# EAGLE design Arduino Electronic Load_Ver06 (EAGLE 7.4.0)
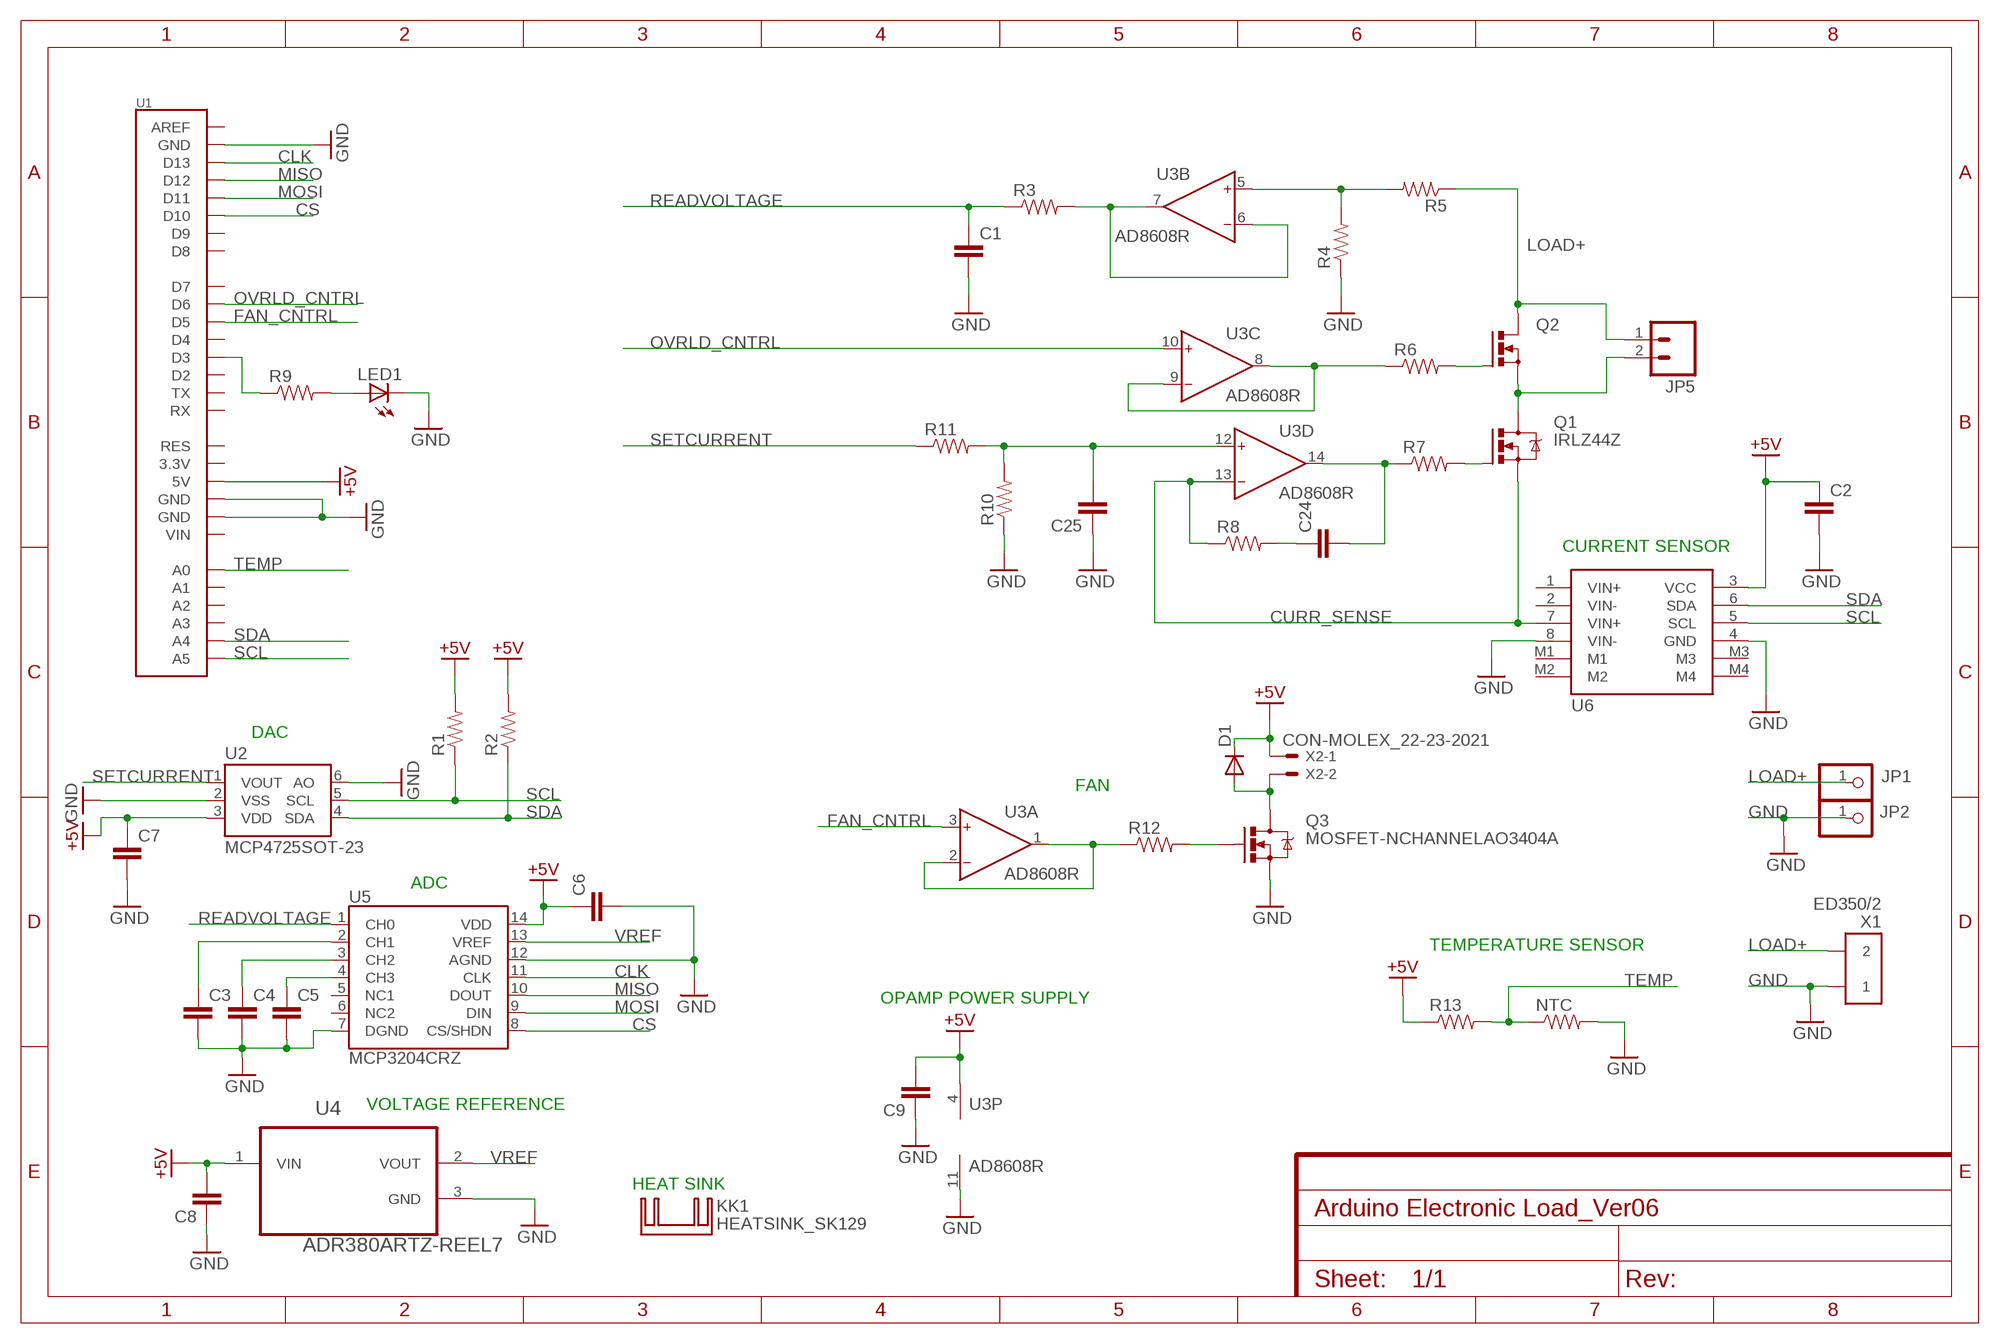
[diagram p0: schematic, sheet 1]

## Parts
C1  CAP0603-CAP  [0603-CAP]
C2  CAP0603-CAP  [0603-CAP]
C3  CAP0603-CAP  [0603-CAP]
C4  CAP0603-CAP  [0603-CAP]
C5  CAP0603-CAP  [0603-CAP]
C6  CAP0603-CAP  [0603-CAP]
C7  CAP0603-CAP  [0603-CAP]
C8  CAP0603-CAP  [0603-CAP]
C9  CAP0603-CAP  [0603-CAP]
C24  CAP0603-CAP  [0603-CAP]
C25  CAP0603-CAP  [0603-CAP]
D1  DIODEPTH  [DIODE-1N4001]
JP1  PINHEAD_PINHD-1X1  [PINHEAD_1X01]
JP2  PINHEAD_PINHD-1X1  [PINHEAD_1X01]
JP5  M02  [1X02_LONGPADS]
KK1  HEATSINK_SK129  [HEATSINK_SK129-HOLE]
LED1  LED5MM  [LED5MM]
NTC  RESISTOR0402-RES  [0402-RES]
Q1  IRLZ44Z  [TO220BV_1]
Q2  PMOSFET_NTO220BV  [TO220BV]
Q3  MOSFET-NCHANNELAO3404A  [SOT23-3]
R1  RESISTOR0603-RES  [0603-RES]
R2  RESISTOR0603-RES  [0603-RES]
R3  RESISTOR0603-RES  [0603-RES]
R4  RESISTOR0603-RES  [0603-RES]
R5  RESISTOR0603-RES  [0603-RES]
R6  RESISTOR0603-RES  [0603-RES]
R7  RESISTOR0603-RES  [0603-RES]
R8  RESISTOR0603-RES  [0603-RES]
R9  RESISTOR0603-RES  [0603-RES]
R10  RESISTOR0603-RES  [0603-RES]
R11  RESISTOR0603-RES  [0603-RES]
R12  RESISTOR0603-RES  [0603-RES]
R13  RESISTOR0603-RES  [0603-RES]
U1  ARDUINO_SHIELD  [DUEMILANOVE_SHIELD]
U2  MCP4725SOT-23  [SOT23-6]
U3  AD8608R  [SO14]
U4  ADR380ARTZ-REEL7  [SOT95P237X112-3N]
U5  MCP3204CRZ  [SOIC-14]
U6  INA219  [INA219]
X1  ED350/2  [ED350/2]
X2  CON-MOLEX_22-23-2021  [CON-MOLEX_22-23-2021]

## Nets
+5V: C2.1 C6.1 C7.1 C8.2 C9.2 D1.C R1.2 R2.2 R13.1 U1.5V U2.3(VDD) U3.4(P:V+) U4.1(VIN) U5.14(VDD) U6.3(VCC) X2.1
CLK: U1.D13 U5.11(CLK)
CS: U1.D10 U5.8(CS/SHDN)
CURR_SENSE: Q1.S R8.1 U3.13(D:IN-) U6.7(VIN+)
FAN_CNTRL: U1.D5 U3.3(A:IN+)
GND: C1.2 C2.2 C3.2 C4.2 C5.2 C6.2 C7.2 C8.1 C9.1 C25.1 JP2.1 LED1.K(C) NTC.2 Q3.2(S) R4.1 R10.1 U1.GND@0(GND) U1.GND@1(GND) U1.GND@2(GND) U2.2(VSS) U2.6(AO) U3.11(P:V-) U4.3(GND) U5.7(DGND) U5.12(AGND) U6.4(GND) U6.8(VIN-) X1.P$1
LOAD+: JP1.1 JP5.1 Q2.D R5.1 X1.P$2
MISO: U1.D12 U5.10(DOUT)
MOSI: U1.D11 U5.9(DIN)
N$1: R9.1 U1.D3
N$2: LED1.A R9.2
N$3: R12.1 U3.1(A:OUT) U3.2(A:IN-)
N$4: Q3.1(G) R12.2
N$6: C3.1 U5.2(CH1)
N$7: R3.2 U3.6(B:IN-) U3.7(B:OUT)
N$8: R6.1 U3.8(C:OUT) U3.9(C:IN-)
N$9: R4.2 R5.2 U3.5(B:IN+)
N$10: Q2.G R6.2
N$11: JP5.2 Q1.D Q2.S
N$12: Q1.G R7.2
N$13: C24.2 R7.1 U3.14(D:OUT)
N$14: C4.1 U5.3(CH2)
N$15: C24.1 R8.2
N$16: C5.1 U5.4(CH3)
N$17: C25.2 R10.2 R11.2 U3.12(D:IN+)
N$18: D1.A Q3.3(D) X2.2
OVRLD_CNTRL: U1.D6 U3.10(C:IN+)
READVOLTAGE: C1.1 R3.1 U5.1(CH0)
SCL: R1.1 U1.A5 U2.5(SCL) U6.5(SCL)
SDA: R2.1 U1.A4 U2.4(SDA) U6.6(SDA)
SETCURRENT: R11.1 U2.1(VOUT)
TEMP: NTC.1 R13.2 U1.A0
VREF: U4.2(VOUT) U5.13(VREF)
Unconnected: U1.3.3V U1.A1 U1.A2 U1.A3 U1.AREF U1.D2 U1.D4 U1.D7 U1.D8 U1.D9 U1.RES U1.RX U1.TX U1.VIN U5.5(NC1) U5.6(NC2) U6.1(VIN+) U6.2(VIN-) U6.M1 U6.M2 U6.M3 U6.M4

## Notes on the sheet
- CURRENT SENSOR
- DAC
- FAN
- ADC
- TEMPERATURE SENSOR
- OPAMP POWER SUPPLY
- VOLTAGE REFERENCE
- HEAT SINK

## Library data of the parts
C1-C5 = myLibrary:CAP: Capacitor Standard 0603 ceramic capacitor, and 0.1" leaded capacitor.; MANUFACTURING: Murata Electronics North America; MANUFACTURING_NUM: GRM188R71C104KA01D; PACKAGE: GRM188R71C104KA01D; VENDOR: 0603-CAP; VENDOR_PART_NUM: Digikey
C6-C9 C24 C25 = myLibrary:CAP: Capacitor Standard 0603 ceramic capacitor, and 0.1" leaded capacitor.
D1 = myLibrary:DIODE: Diode These are standard reverse protection diodes and small signal diodes. SMA package can handle up to about 1A. SOD-323 can handle about 200mA. What the SOD-323 package when ordering, there are some mfgs out there that are 5-pin packages.
JP1 JP2 = myLibrary:PINHEAD_PINHD-1X1: PIN HEADER
JP5 = myLibrary:M02: Header 2 Standard 2-pin 0.1" header. Use with straight break away headers (SKU : PRT-00116), right angle break away headers (PRT-00553), swiss pins (PRT-00743), machine pins (PRT-00117), and female headers (PRT-00115). Molex polarized connector foot print use with SKU : PRT-08233 with associated crimp pins and housings.
KK1 = myLibrary:HEATSINK_SK129: HEATSINK manufacturer Fischer/distributor Buerklin
LED1 = myLibrary:LED: LEDs Standard schematic elements and footprints for 5mm, 3mm, 1206, and 0603 sized LEDs. 5mm - Spark Fun Electronics SKU : COM-00529 (and others)
NTC R1-R13 = myLibrary:RESISTOR: Resistor Basic schematic elements and footprints for 0603, 1206, and PTH 1/10th watt (small) resistors.
Q1 = myLibrary:IRLZ44Z: N-Channel HEXFET® Power MOSFET Logic Level AUTOMOTIVE MOSFET Source: http://www.irf.com/product-info/datasheets/data/irlz44zpbf.pdf
Q2 = myLibrary:PMOSFET_N: Power MOSFET N-Channel
Q3 = myLibrary:MOSFET-NCHANNEL: Common NMOSFET Parts MFG P/N Store ID Prod ID FDD8780 TRANS-09984 SI7820DN TRANS-11055 FDS6630A IC-08089 2N7002PW TRANS-11151 FQP30N06L COM-10213 TRANS-10060 BSS123LT1G TRANS-08345 BSS138 TRANS-00830 BS170 2N7000
U1 = myLibrary:ARDUINO_SHIELD
U2 = myLibrary:MCP4725: Microchip 12-bit I2C DAC, SOT23-6
U3 = myLibrary:AD8608: Precision, Low Noise, CMOS, Rail-to-Rail, Input/Output Operational Amplifiers http://www.analog.com/static/imported-files/data_sheets/AD8605_8606_8608.pdf
U4 = myLibrary:ADR380ARTZ-REEL7: Precision Low Drift 2.048 V/2.500 V SOT-23 Voltage Reference
U5 = myLibrary:MCP3204: IC ADC 12BIT 2.7V 4CH SPI 14SOIC
U6 = myLibrary:INA219
X1 = myLibrary:ED350/2: ED350/X (5.0 mm) TERMINAL BLOCK 5MM VERT 2POS PCB Datasheet http://www.on-shore.com/sites/default/files/manuals/edz350.pdf
X2 = myLibrary:CON-MOLEX_22-23-2021: .100" (2.54mm) Center Header - 2 Pin

## Board
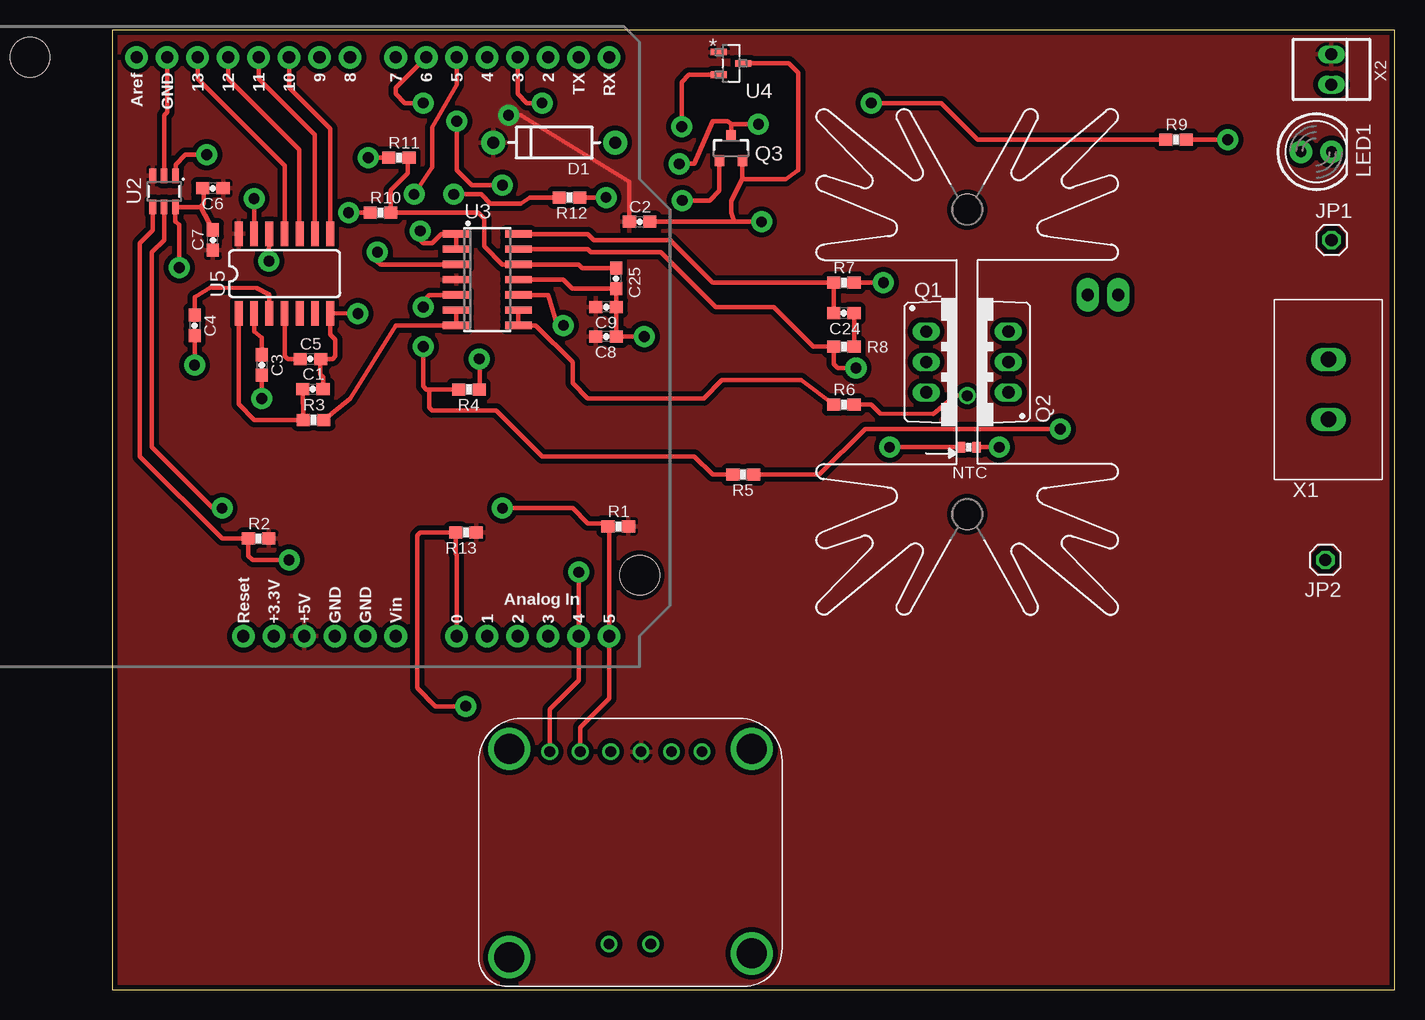
[diagram p1: board, top side]
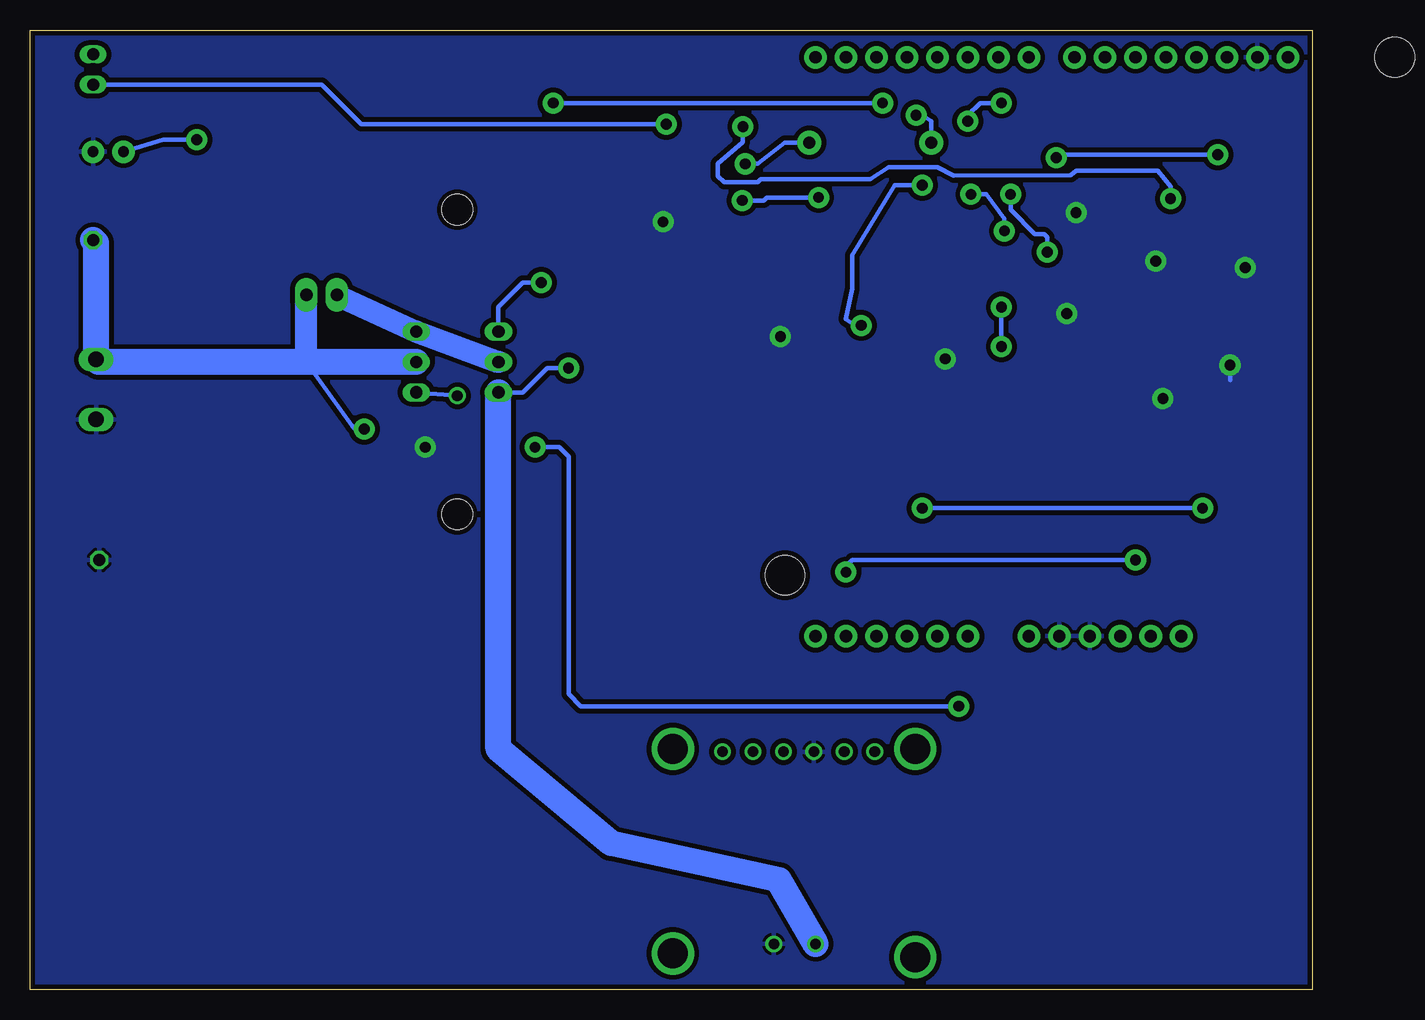
[diagram p2: board, bottom side, seen from below]

Size 106.86 x 80 mm. Coordinates in mm from the lower left corner, seen from the top.
Outline: 0,0 106.86,0 106.86,80 0,80 0,0
Copper layers (1*16): Top 0.035mm / dielectric 1.5mm / Bottom 0.035mm
Design rules "Othermill-DRC-EA-15mil V02": minimum track width 15mil, minimum drill 35mil, track to track 15mil, track to pad 15mil, pad to pad 15mil, via to via 15mil, smd to smd 0mil, copper to edge 1mil, drill to drill 1mil, minimum pad ring 10mil, minimum via ring 10mil, stop-mask expansion 1mil, vias tented up to drill 30mil, thermal gap 10mil

### Footprints (pad centres in the part's own frame; a part is rotated, then mirrored left to right if it is on the bottom)
0603-CAP = smd 1.1 x 1: 1 -0.85,0; 2 0.85,0
DIODE-1N4001 = drill 1 pad 1.981: A -5.08,0; C 5.08,0
PINHEAD_1X01 = drill 1.016 octagon: 1 0,0
1X02_LONGPADS = drill 1.016 pad 1.88 long: 1 0,0; 2 2.54,0
HEATSINK_SK129-HOLE = hole 2.54: -12.7,-0.889; 12.7,-0.889
LED5MM = drill 0.889 pad 1.88: A -1.27,0; K 1.27,0
0402-RES = smd 0.7 x 0.9: 1 -0.65,0; 2 0.65,0
TO220BV_1 = drill 1.016 long: D 0,-2.54; G -2.54,-2.54; S 2.54,-2.54
TO220BV = drill 1.016 long: D 0,-2.54; G -2.54,-2.54; S 2.54,-2.54
SOT23-3 = smd 0.8 x 0.9: 1 -0.95,-1; 2 0.95,-1; 3 0,1.1
0603-RES = smd 1.1 x 1: 1 -0.85,0; 2 0.85,0
DUEMILANOVE_SHIELD = drill 1.016 pad 1.88: 3.3V 50.8,26.67; 5V 50.8,29.21; A0 50.8,41.91; A1 50.8,44.45; A2 50.8,46.99; A3 50.8,49.53; A4 50.8,52.07; A5 50.8,54.61; AREF 2.54,15.24; D2 2.54,49.53; D3 2.54,46.99; D4 2.54,44.45; D5 2.54,41.91; D6 2.54,39.37; D7 2.54,36.83; D8 2.54,33.02; D9 2.54,30.48; D10 2.54,27.94; D11 2.54,25.4; D12 2.54,22.86; D13 2.54,20.32; GND@0 50.8,31.75; GND@1 50.8,34.29; GND@2 2.54,17.78; RES 50.8,24.13; RX 2.54,54.61; TX 2.54,52.07; VIN 50.8,36.83 | hole 3.302: 45.72,57.15; 2.54,6.35
SOT23-6 = smd 0.55 x 1.2: 1 0.95,1.3; 2 0,1.3; 3 -0.95,1.3; 4 -0.95,-1.3; 5 0,-1.3; 6 0.95,-1.3
SO14 = smd 0.6 x 2.2: 1 -3.81,-2.6; 2 -2.54,-2.6; 3 -1.27,-2.6; 4 0,-2.6; 5 1.27,-2.6; 6 2.54,-2.6; 7 3.81,-2.6; 8 3.81,2.6; 9 2.54,2.6; 10 1.27,2.6; 11 0,2.6; 12 -1.27,2.6; 13 -2.54,2.6; 14 -3.81,2.6
SOT95P237X112-3N = smd 1.321 x 0.559: 1 -1.016,0.94; 2 -1.016,-0.94; 3 1.016,0
SOIC-14 = smd 0.66 x 2.032: 1 -4.445,-3.315; 2 -3.175,-3.315; 3 -1.905,-3.315; 4 -0.635,-3.315; 5 0.635,-3.315; 6 1.905,-3.315; 7 3.175,-3.315; 8 3.175,3.315; 9 1.905,3.315; 10 0.635,3.315; 11 -0.635,3.315; 12 -1.905,3.315; 13 -3.175,3.315; 14 -4.445,3.315
INA219 = drill 0.889: 1 -5.965,2.781; 2 -3.425,2.781; 3 -0.885,2.781; 4 1.643,2.781; 5 4.183,2.781; 6 6.723,2.781; 7 1.79,18.81; 8 -1.69,18.81 | drill 2.5: M1 -10.1,2.54; M2 -10.1,19.6; M3 10.1,19.9; M4 10.1,2.54
ED350/2 = drill 1.3 long: P$1 0,-2.5; P$2 0,2.5
CON-MOLEX_22-23-2021 = drill 1 long: 1 -1.27,0; 2 1.27,0

### Placement (x,y rotation side)
C1  16.71,50.06 0 top
C2  43.94,64.01 0 top
C3  12.45,52.07 270 top
C4  6.86,55.37 270 top
C5  16.51,52.58 0 top
C6  8.38,66.8 180 top
C7  8.38,62.48 90 top
C8  41.15,54.43 180 top
C9  41.15,56.9 180 top
C24  60.96,56.39 180 top
C25  41.99,59.28 90 top
D1  36.83,70.61 180 top
JP1  101.6,62.48 0 top
JP2  101.09,35.81 180 top
JP5  83.82,57.91 180 top
KK1  70.36,52.32 90 top
LED1  100.33,69.85 0 top
NTC  71.37,45.21 0 top
Q1  70.36,52.32 270 top
Q2  72.14,52.32 90 top
Q3  51.56,70.1 0 top
R1  42.16,38.61 0 top
R2  12.19,37.59 0 top
R3  16.76,47.5 0 top
R4  29.72,50.04 180 top
R5  52.58,42.93 180 top
R6  60.96,48.77 0 top
R7  60.96,58.93 0 top
R8  60.96,53.59 0 top
R9  88.65,70.87 0 top
R10  22.35,64.77 0 top
R11  23.88,69.34 0 top
R12  38.1,66.04 0 top
R13  29.46,38.1 180 top
U1  -13.21,80.26 270 top
U2  4.32,66.55 0 top
U3  31.24,59.18 270 top
U4  51.56,77.22 0 top
U5  14.99,59.69 0 top
U6  43.18,22.61 180 top
X1  101.35,50.04 0 top
X2  101.6,76.71 270 top

### Tracks (layer width: path | path; a pad name or v marks a point on that pad's centre or on a via)
+5V  (via drill 0.9 pad 1.75)
  Top 0.381: v33.02,72.9 34.04,72.9 43.08,67.36 C2.1
  Bottom 0.381: D1.C 31.75,72.39 32.51,72.9 v33.02,72.9
  pour Top (isolate 0.406): -0.25,0 -0.25,80.77 107.19,80.77 107.19,-0.51 -0.25,-0.51
CLK
  Top 0.381: U5.11 14.35,68.71 7.11,75.95 U1.D13
CS
  Top 0.381: U5.8 18.16,71.75 14.73,75.18 U1.D10
CURR_SENSE  (via drill 0.9 pad 1.75)
  Top 0.381: R8.1 58.42,53.59 55.12,56.9 50.29,56.9 45.72,61.47 39.88,61.47 39.62,61.72 U3.13 | 60.2,53.51 R8.1 | R8.1 60.11,52.16 60.45,51.82 v61.98,51.82
  Bottom 0.381: Q1.S 65.79,49.78 63.75,51.82 v61.98,51.82
  Bottom 2.159: U6.7 44.45,9.14 58.42,12.19 67.82,20.07 Q1.S
FAN_CNTRL  (via drill 0.9 pad 1.75)
  Top 0.381: U3.3 22.35,60.45 22.1,60.71 v22.1,61.47 | U1.D5 28.7,75.44 26.67,71.88 26.67,68.58 v25.15,66.29
  Bottom 0.381: v22.1,61.47 22.1,62.74 22.35,62.99 23.11,62.99 25.15,65.02 v25.15,66.29
GND  (via drill 0.9 pad 1.75)
  Top 0.381: NTC.2 v73.91,45.21 | R4.1 30.61,51.03 v30.58,52.58 | U3.11 37.59,59.18 38.34,58.43 C25.1 C9.1 C8.1 v44.32,54.43 | v20.47,56.36 U5.7 18.16,54.61 18.59,54.18 18.59,52.81 18.36,52.58 C5.2 17.35,52.57 17.35,51.28 17.56,51.07 C1.2 | U5.12 v13.06,60.73 | C2.2 51.82,64.01 | 51.82,64.01 v54.1,64.01 | Q3.2 52.51,67.57 | 52.51,67.57 56.13,67.56 57.15,68.33 57.15,76.45 56.39,77.22 U4.3 | 52.51,67.57 51.56,65.79 51.56,64.77 51.82,64.01 | U1.GND@2 4.57,73.15 4.32,72.9 U2.2 | 7.34,65.25 U2.6 5.26,64.03 5.59,63.75 v5.59,60.2 | 7.34,65.25 7.62,65.53 7.62,66.71 C6.2 | C7.2 7.37,65.22 7.34,65.25 | C4.2 v6.86,52.07 | C3.2 v12.45,49.28 | R10.1 v19.68,64.77
  Bottom 0.381: v6.86,52.07 6.86,50.8
  pour Bottom (isolate 0.406): -0.25,80.01 107.19,80.01 107.19,-0.25 -0.25,-0.25
LOAD+  (via drill 0.9 pad 1.75)
  Top 0.381: R5.1 58.93,42.93 62.74,46.74 v78.99,46.74
  Bottom 0.381: v78.99,46.74 79.76,46.74 80.01,46.99 83.82,52.32
  Bottom 1.829: 83.82,52.32 JP5.1
  Bottom 2.159: Q2.D 83.82,52.32 101.13,52.32 X1.P$2 101.35,62.23 JP1.1
MISO
  Top 0.381: U5.10 15.6,63.03 15.6,70 9.65,75.95 U1.D12
MOSI
  Top 0.381: U5.9 16.87,63.03 16.87,71.27 12.19,75.95 U1.D11
N$1  (via drill 0.9 pad 1.75)
  Top 0.381: R9.1 72.14,70.87 69.09,73.91 v63.25,73.91 | v35.81,73.91 34.54,73.91 33.78,74.68 U1.D3
  Bottom 0.381: v63.25,73.91 v35.81,73.91
N$2  (via drill 0.9 pad 1.75)
  Top 0.381: R9.2 v92.96,70.87
  Bottom 0.381: LED1.A 95.76,70.87 v92.96,70.87
N$3  (via drill 0.9 pad 1.75)
  Top 0.381: U3.2 U3.1 27.43,62.99 26.67,62.23 25.91,62.23 25.65,62.48 v25.65,63.25 | R12.1 34.8,66.04 34.04,65.53 31.5,65.53 30.73,66.29 v28.45,66.29
  Bottom 0.381: v25.65,63.25 25.65,64.26 27.18,66.29 v28.45,66.29
N$4  (via drill 0.9 pad 1.75)
  Top 0.381: Q3.1 50.6,69.09 50.6,66.6 49.78,65.79 v47.5,65.79 | R12.2 v41.15,66.04
  Bottom 0.381: v47.5,65.79 45.72,65.79 45.47,66.04 v41.15,66.04
N$6
  Top 0.381: U5.2 11.84,54.84 12.45,54.36 C3.1
N$7
  Top 0.381: U3.6 U3.7 23.62,55.37 19.81,49.28 R3.2
N$8
  Top 0.381: U3.9 U3.8 35.31,55.37 38.35,52.32 38.35,50.55 39.62,49.28 49.28,49.28 50.8,50.8 57.4,50.8 R6.1
N$9  (via drill 0.9 pad 1.75)
  Top 0.381: U3.5 26.42,57.91 25.91,57.4 v25.91,56.9 | v25.91,53.59 25.91,50.29 26.16,50.04 R4.2 26.42,50.04 26.42,48.51 26.67,48.26 32,48.26 35.81,44.45 48.51,44.45 50.04,42.93 R5.2
  Bottom 0.381: v25.91,56.9 v25.91,53.59
N$10  (via drill 0.9)
  Top 0.381: v71.25,49.51 70.23,49.51 68.4,47.98 64.01,48.01 63.25,48.77 R6.2
  Bottom 0.381: Q2.G v71.25,49.51
N$11
  Bottom 1.829: Q1.D Q2.S JP5.2
N$12  (via drill 0.9 pad 1.75)
  Top 0.381: v64.26,58.93 R7.2
  Bottom 0.381: Q1.G 67.82,56.9 65.79,58.93 65.02,58.93 v64.26,58.93
N$13
  Top 0.381: C24.2 R7.1 50.04,58.93 46.48,62.48 40.13,62.48 39.62,62.99 U3.14
N$14
  Top 0.381: U5.3 13.08,57.94 12.04,58.5 8.15,58.52 6.86,57.73 C4.1
N$15
  Top 0.381: C24.1 R8.2
N$16
  Top 0.381: C5.1 14.61,52.58 14.35,52.83 U5.4
N$17
  Top 0.381: 24.69,69.31 R11.2 24.64,69.25 24.64,68.07 23.2,66.64 R10.2 30.48,64.77 30.99,64.26 30.99,61.98 32.51,60.45 U3.12 38.86,60.45 39.18,60.13 C25.2
N$18  (via drill 0.9 pad 1.75)
  Top 0.381: Q3.3 51.56,72.14 | 51.56,72.14 51.31,72.39 50.04,72.39 48.51,68.83 v47.24,68.83 | 51.56,72.14 v53.85,72.14
  Bottom 0.381: v53.85,72.14 79.25,72.14 82.55,75.44 X2.2 | D1.A 43.94,70.61 46.23,68.83 v47.24,68.83
OVRLD_CNTRL  (via drill 0.9 pad 1.75)
  Top 0.381: U3.10 36.32,57.91 37.08,55.37 v37.59,55.37 | v25.91,73.91 24.38,73.91 23.62,74.68 23.62,75.18 U1.D6 | v28.7,72.39 28.7,68.33 29.97,67.06 v32.51,67.06
  Bottom 0.381: v25.91,73.91 27.69,73.91 28.7,72.9 v28.7,72.39 | v37.59,55.37 38.1,55.37 38.86,55.88 38.35,58.42 38.35,61.21 34.8,67.06 v32.51,67.06
READVOLTAGE
  Top 0.381: 10.58,56.34 U5.1 10.54,48.79 11.84,47.5 R3.1 C1.1
SCL  (via drill 0.9 pad 1.75)
  Top 0.381: v9.14,40.13 8.38,40.13 3.3,45.21 3.3,61.47 4.32,62.48 U2.5 | v32.51,40.13 38.35,40.13 39.62,38.86 41.06,38.86 R1.1 41.4,38.52 U1.A5 41.4,24.28 38.99,21.87 38.99,19.83 U6.5
  Bottom 0.381: v9.14,40.13 v32.51,40.13
SDA  (via drill 0.9 pad 1.75)
  Top 0.381: U2.4 3.38,65.24 3.38,63.32 2.29,62.23 2.29,44.45 9.14,37.59 R2.1 11.34,36.16 11.68,35.81 v14.73,35.81 | v38.86,34.8 U1.A4 38.86,25.78 36.45,23.37 36.45,19.83 U6.6
  Bottom 0.381: v38.86,34.8 38.86,35.31 38.35,35.81 v14.73,35.81
SETCURRENT  (via drill 0.9 pad 1.75)
  Top 0.381: R11.1 v21.34,69.34 | v7.87,69.6 6.1,69.6 5.27,68.77 U2.1
  Bottom 0.381: v21.34,69.34 21.08,69.6 v7.87,69.6
TEMP  (via drill 0.9 pad 1.75)
  Top 0.381: v64.77,45.21 NTC.1 | v29.46,23.62 26.92,23.62 25.4,25.15 25.4,37.85 25.65,38.1 R13.2 28.6,38.09 28.6,36.32 28.7,36.22 U1.A0
  Bottom 0.381: v29.46,23.62 60.96,23.62 61.98,24.64 61.98,44.45 62.74,45.21 v64.77,45.21
VREF  (via drill 0.9 pad 1.75)
  Top 0.381: U5.13 v11.81,65.94 | U4.2 48.06,76.28 47.45,75.67 v47.45,71.93
  Bottom 0.381: v11.81,65.94 11.81,66.95 12.88,68.28 19.66,68.28 20.14,67.89 29.87,67.87 31.24,68.58 35.31,68.58 36.83,67.56 45.97,67.56 46.23,67.31 49.02,67.31 49.53,67.82 49.53,68.83 47.45,70.64 v47.45,71.93